# EAGLE schematic badge (EAGLE 8.3.1)
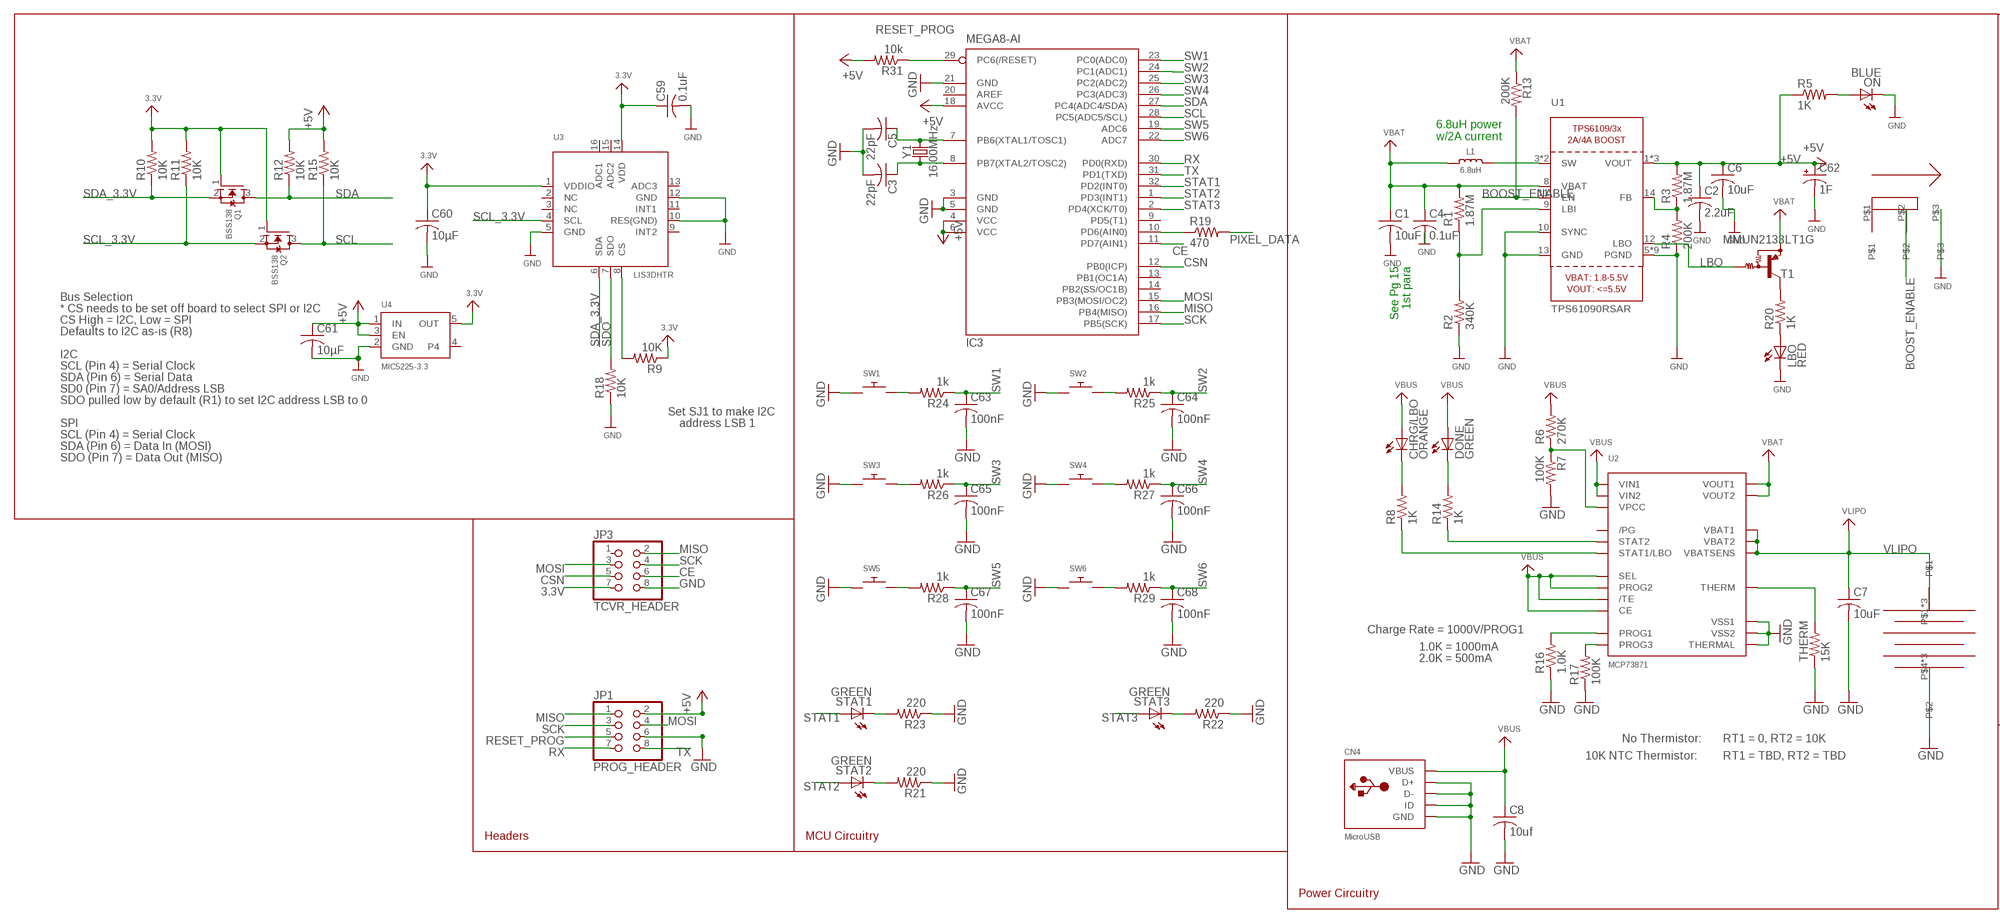
[diagram p0: schematic, sheet 1, part 1 of 2]
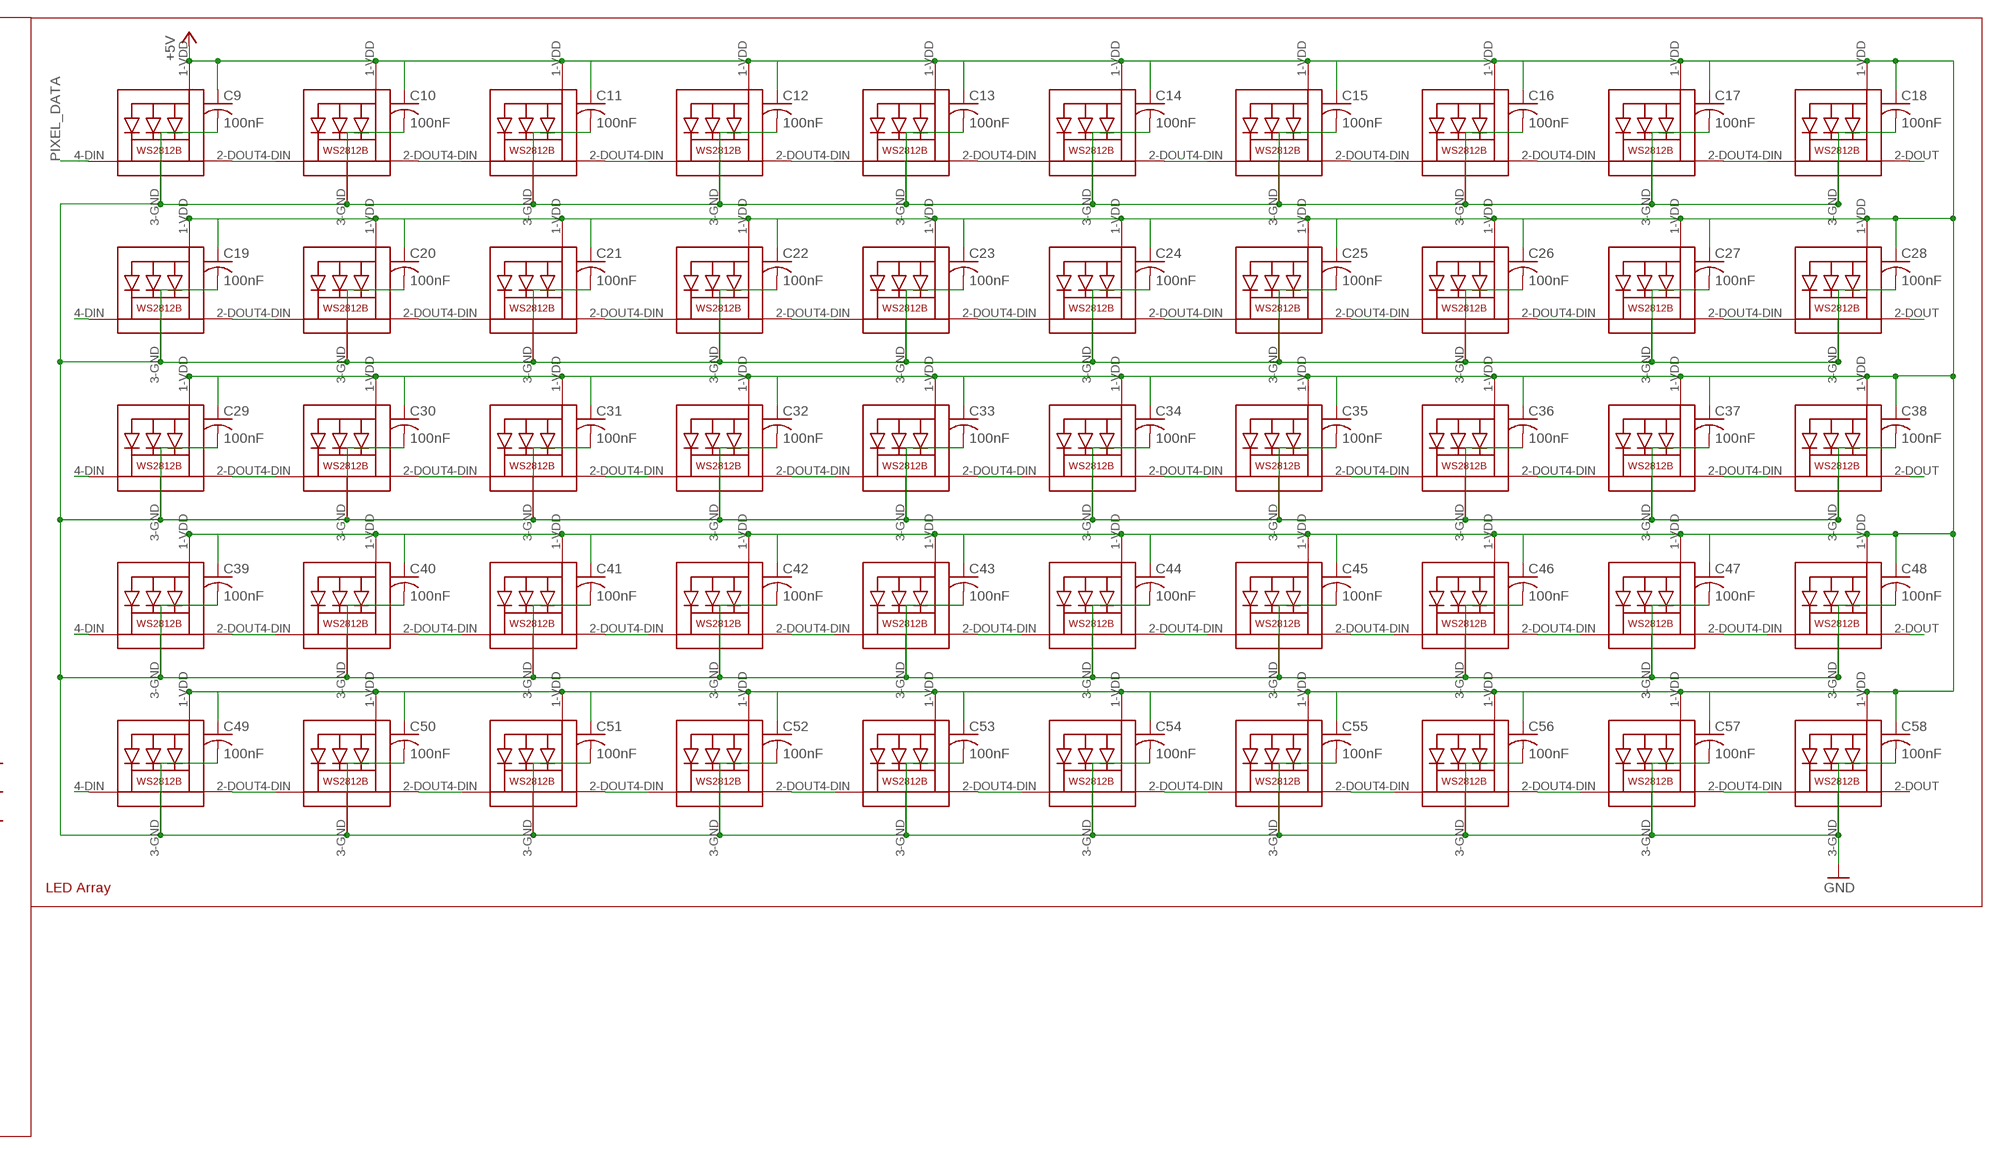
[diagram p1: schematic, sheet 1, part 2 of 2]

## Parts
C1  10uF  C-USC1210  [C1210]
C2  2.2uF  C-USC0805  [C0805]
C3  22pF  C-USC0603  [C0603]
C4  0.1uF  C-USC0805  [C0805]
C5  22pF  C-USC0603  [C0603]
C6  10uF  C-USC1210  [C1210]
C7  10uF  C-USC1210  [C1210]
C8  10uf  C-USC0805  [C0805]
C9  100nF  C-USC0603  [C0603]
C10  100nF  C-USC0603  [C0603]
C11  100nF  C-USC0603  [C0603]
C12  100nF  C-USC0603  [C0603]
C13  100nF  C-USC0603  [C0603]
C14  100nF  C-USC0603  [C0603]
C15  100nF  C-USC0603  [C0603]
C16  100nF  C-USC0603  [C0603]
C17  100nF  C-USC0603  [C0603]
C18  100nF  C-USC0603  [C0603]
C19  100nF  C-USC0603  [C0603]
C20  100nF  C-USC0603  [C0603]
C21  100nF  C-USC0603  [C0603]
C22  100nF  C-USC0603  [C0603]
C23  100nF  C-USC0603  [C0603]
C24  100nF  C-USC0603  [C0603]
C25  100nF  C-USC0603  [C0603]
C26  100nF  C-USC0603  [C0603]
C27  100nF  C-USC0603  [C0603]
C28  100nF  C-USC0603  [C0603]
C29  100nF  C-USC0603  [C0603]
C30  100nF  C-USC0603  [C0603]
C31  100nF  C-USC0603  [C0603]
C32  100nF  C-USC0603  [C0603]
C33  100nF  C-USC0603  [C0603]
C34  100nF  C-USC0603  [C0603]
C35  100nF  C-USC0603  [C0603]
C36  100nF  C-USC0603  [C0603]
C37  100nF  C-USC0603  [C0603]
C38  100nF  C-USC0603  [C0603]
C39  100nF  C-USC0603  [C0603]
C40  100nF  C-USC0603  [C0603]
C41  100nF  C-USC0603  [C0603]
C42  100nF  C-USC0603  [C0603]
C43  100nF  C-USC0603  [C0603]
C44  100nF  C-USC0603  [C0603]
C45  100nF  C-USC0603  [C0603]
C46  100nF  C-USC0603  [C0603]
C47  100nF  C-USC0603  [C0603]
C48  100nF  C-USC0603  [C0603]
C49  100nF  C-USC0603  [C0603]
C50  100nF  C-USC0603  [C0603]
C51  100nF  C-USC0603  [C0603]
C52  100nF  C-USC0603  [C0603]
C53  100nF  C-USC0603  [C0603]
C54  100nF  C-USC0603  [C0603]
C55  100nF  C-USC0603  [C0603]
C56  100nF  C-USC0603  [C0603]
C57  100nF  C-USC0603  [C0603]
C58  100nF  C-USC0603  [C0603]
C59  0.1uF  C-USC0603  [C0603]
C60  10µF  C-USC0805  [C0805]
C61  10µF  C-USC0805  [C0805]
C62  1F  CPOL-USE5-8.5  [E5-8,5]
C63  100nF  C-USC0603  [C0603]
C64  100nF  C-USC0603  [C0603]
C65  100nF  C-USC0603  [C0603]
C66  100nF  C-USC0603  [C0603]
C67  100nF  C-USC0603  [C0603]
C68  100nF  C-USC0603  [C0603]
CHRG/LBO  ORANGE  ADAFRUIT_LEDCHIPLED_0603  [ADAFRUIT_CHIPLED_0603]
CN4  MicroUSB  USBMICRO_20329  [4UCONN_20329]
DONE  GREEN  ADAFRUIT_LEDCHIPLED_0603  [ADAFRUIT_CHIPLED_0603]
IC3  MEGA8-AI  [TQFP32-08]
JP1  PROG_HEADER  PINHD-2X4  [2X04]
JP3  TCVR_HEADER  PINHD-2X4  [2X04]
L1  6.8uH  INDUCTORTDK_VLC5045  [INDUCTOR_5X5MM_TDK_VLC5045]
LBO  RED  ADAFRUIT_LEDCHIPLED_0603  [ADAFRUIT_CHIPLED_0603]
LED1  WS2812B5050-NARROW  [WS2812B-NARROW]
LED2  WS2812B5050-NARROW  [WS2812B-NARROW]
LED3  WS2812B5050-NARROW  [WS2812B-NARROW]
LED4  WS2812B5050-NARROW  [WS2812B-NARROW]
LED5  WS2812B5050-NARROW  [WS2812B-NARROW]
LED6  WS2812B5050-NARROW  [WS2812B-NARROW]
LED7  WS2812B5050-NARROW  [WS2812B-NARROW]
LED8  WS2812B5050-NARROW  [WS2812B-NARROW]
LED9  WS2812B5050-NARROW  [WS2812B-NARROW]
LED10  WS2812B5050-NARROW  [WS2812B-NARROW]
LED11  WS2812B5050-NARROW  [WS2812B-NARROW]
LED12  WS2812B5050-NARROW  [WS2812B-NARROW]
LED13  WS2812B5050-NARROW  [WS2812B-NARROW]
LED14  WS2812B5050-NARROW  [WS2812B-NARROW]
LED15  WS2812B5050-NARROW  [WS2812B-NARROW]
LED16  WS2812B5050-NARROW  [WS2812B-NARROW]
LED17  WS2812B5050-NARROW  [WS2812B-NARROW]
LED18  WS2812B5050-NARROW  [WS2812B-NARROW]
LED19  WS2812B5050-NARROW  [WS2812B-NARROW]
LED20  WS2812B5050-NARROW  [WS2812B-NARROW]
LED21  WS2812B5050-NARROW  [WS2812B-NARROW]
LED22  WS2812B5050-NARROW  [WS2812B-NARROW]
LED23  WS2812B5050-NARROW  [WS2812B-NARROW]
LED24  WS2812B5050-NARROW  [WS2812B-NARROW]
LED25  WS2812B5050-NARROW  [WS2812B-NARROW]
LED26  WS2812B5050-NARROW  [WS2812B-NARROW]
LED27  WS2812B5050-NARROW  [WS2812B-NARROW]
LED28  WS2812B5050-NARROW  [WS2812B-NARROW]
LED29  WS2812B5050-NARROW  [WS2812B-NARROW]
LED30  WS2812B5050-NARROW  [WS2812B-NARROW]
LED31  WS2812B5050-NARROW  [WS2812B-NARROW]
LED32  WS2812B5050-NARROW  [WS2812B-NARROW]
LED33  WS2812B5050-NARROW  [WS2812B-NARROW]
LED34  WS2812B5050-NARROW  [WS2812B-NARROW]
LED35  WS2812B5050-NARROW  [WS2812B-NARROW]
LED36  WS2812B5050-NARROW  [WS2812B-NARROW]
LED37  WS2812B5050-NARROW  [WS2812B-NARROW]
LED38  WS2812B5050-NARROW  [WS2812B-NARROW]
LED39  WS2812B5050-NARROW  [WS2812B-NARROW]
LED40  WS2812B5050-NARROW  [WS2812B-NARROW]
LED41  WS2812B5050-NARROW  [WS2812B-NARROW]
LED42  WS2812B5050-NARROW  [WS2812B-NARROW]
LED43  WS2812B5050-NARROW  [WS2812B-NARROW]
LED44  WS2812B5050-NARROW  [WS2812B-NARROW]
LED45  WS2812B5050-NARROW  [WS2812B-NARROW]
LED46  WS2812B5050-NARROW  [WS2812B-NARROW]
LED47  WS2812B5050-NARROW  [WS2812B-NARROW]
LED48  WS2812B5050-NARROW  [WS2812B-NARROW]
LED49  WS2812B5050-NARROW  [WS2812B-NARROW]
LED50  WS2812B5050-NARROW  [WS2812B-NARROW]
ON  BLUE  ADAFRUIT_LEDCHIPLED_0603  [ADAFRUIT_CHIPLED_0603]
Q1  BSS138  MOSFET-NWIDE  [SOT23-WIDE]
Q2  BSS138  MOSFET-NWIDE  [SOT23-WIDE]
R1  1.87M  R-US_R0805  [R0805]
R2  340K  R-US_R0805  [R0805]
R3  1.87M  R-US_R0805  [R0805]
R4  200K  R-US_R0805  [R0805]
R5  1K  R-US_R0805  [R0805]
R6  270K  R-US_R0805  [R0805]
R7  100K  R-US_R0805  [R0805]
R8  1K  R-US_R0805  [R0805]
R9  10K  R-US_R0603  [R0603]
R10  10K  R-US_R0603  [R0603]
R11  10K  R-US_R0603  [R0603]
R12  10K  R-US_R0603  [R0603]
R13  200K  R-US_R0805  [R0805]
R14  1K  R-US_R0805  [R0805]
R15  10K  R-US_R0603  [R0603]
R16  1.0K  R-US_R0805  [R0805]
R17  100K  R-US_R0805  [R0805]
R18  10K  R-US_R0603  [R0603]
R19  470  R-US_R0805  [R0805]
R20  1K  R-US_R0805  [R0805]
R21  220  R-US_M0805  [M0805]
R22  220  R-US_M0805  [M0805]
R23  220  R-US_M0805  [M0805]
R24  1k  R-US_R0603  [R0603]
R25  1k  R-US_R0603  [R0603]
R26  1k  R-US_R0603  [R0603]
R27  1k  R-US_R0603  [R0603]
R28  1k  R-US_R0603  [R0603]
R29  1k  R-US_R0603  [R0603]
R31  10k  R-US_M0805  [M0805]
STAT1  GREEN  ADAFRUIT_LEDCHIPLED_0603  [ADAFRUIT_CHIPLED_0603]
STAT2  GREEN  ADAFRUIT_LEDCHIPLED_0603  [ADAFRUIT_CHIPLED_0603]
STAT3  GREEN  ADAFRUIT_LEDCHIPLED_0603  [ADAFRUIT_CHIPLED_0603]
SW1  SWITCH_PUSHBUTTONEVQ-PE  [TACT_PANA-EVQ]
SW2  SWITCH_PUSHBUTTONEVQ-PE  [TACT_PANA-EVQ]
SW3  SWITCH_PUSHBUTTONEVQ-PE  [TACT_PANA-EVQ]
SW4  SWITCH_PUSHBUTTONEVQ-PE  [TACT_PANA-EVQ]
SW5  SWITCH_PUSHBUTTONEVQ-PE  [TACT_PANA-EVQ]
SW6  SWITCH_PUSHBUTTONEVQ-PE  [TACT_PANA-EVQ]
T1  MMUN2133LT1G  TRANSISTOR_MUN2113T1-PNP_DRIVER-SC59-BEC  [TRANSISTOR_SC59-BEC]
THERM  15K  R-US_R0805  [R0805]
U1  TPS61090RSAR  VREG_TPS6103X  [PVQFN-16]
U2  MCP73871  [QFN20_4MM]
U3  LIS3DHTR  ACCEL_LIS3DHTR  [LGA16_3X3MM]
U4  MIC5225-3.3  VREG_SOT23-5  [SOT23-5]
U$17  CL-SB-12A-02T  [CL-SB-12A-02T]
U$22  54_BATTERY_CLIP  [54_BATTERY_CLIP]
Y1  16.00MHz  CRYSTALSMD-3.2X2.5  [CRYSTAL-SMD-3.2X2.5MM]

## Nets
3.3V: C59.1 C60.1 JP3.7 Q1.1(G) Q2.1(G) R9.1 R10.2 R11.2 U3.1(VDDIO) U3.14(VDD) U4.5(OUT)
+5V: C2.1 C6.1 C9.1 C10.1 C11.1 C12.1 C13.1 C14.1 C15.1 C16.1 C17.1 C18.1 C19.1 C20.1 C21.1 C22.1 C23.1 C24.1 C25.1 C26.1 C27.1 C28.1 C29.1 C30.1 C31.1 C32.1 C33.1 C34.1 C35.1 C36.1 C37.1 C38.1 C39.1 C40.1 C41.1 C42.1 C43.1 C44.1 C45.1 C46.1 C47.1 C48.1 C49.1 C50.1 C51.1 C52.1 C53.1 C54.1 C55.1 C56.1 C57.1 C58.1 C61.1 C62.+ IC3.4(VCC) IC3.6(VCC) IC3.18(AVCC) JP1.2 LED1.1-VDD(VDD) LED2.1-VDD(VDD) LED3.1-VDD(VDD) LED4.1-VDD(VDD) LED5.1-VDD(VDD) LED6.1-VDD(VDD) LED7.1-VDD(VDD) LED8.1-VDD(VDD) LED9.1-VDD(VDD) LED10.1-VDD(VDD) LED11.1-VDD(VDD) LED12.1-VDD(VDD) LED13.1-VDD(VDD) LED14.1-VDD(VDD) LED15.1-VDD(VDD) LED16.1-VDD(VDD) LED17.1-VDD(VDD) LED18.1-VDD(VDD) LED19.1-VDD(VDD) LED20.1-VDD(VDD) LED21.1-VDD(VDD) LED22.1-VDD(VDD) LED23.1-VDD(VDD) LED24.1-VDD(VDD) LED25.1-VDD(VDD) LED26.1-VDD(VDD) LED27.1-VDD(VDD) LED28.1-VDD(VDD) LED29.1-VDD(VDD) LED30.1-VDD(VDD) LED31.1-VDD(VDD) LED32.1-VDD(VDD) LED33.1-VDD(VDD) LED34.1-VDD(VDD) LED35.1-VDD(VDD) LED36.1-VDD(VDD) LED37.1-VDD(VDD) LED38.1-VDD(VDD) LED39.1-VDD(VDD) LED40.1-VDD(VDD) LED41.1-VDD(VDD) LED42.1-VDD(VDD) LED43.1-VDD(VDD) LED44.1-VDD(VDD) LED45.1-VDD(VDD) LED46.1-VDD(VDD) LED47.1-VDD(VDD) LED48.1-VDD(VDD) LED49.1-VDD(VDD) LED50.1-VDD(VDD) R3.2 R5.1 R12.2 R15.2 R31.2 U1.1(VOUT) U1.15(VOUT) U1.16(VOUT) U4.1(IN) U4.3(EN)
BOOST_ENABLE: R13.2 U1.11(EN) U$17.P$2
CE: IC3.11(PD7(AIN1)) JP3.6
CSN: IC3.12(PB0(ICP)) JP3.5
GND: C1.2 C2.2 C3.2 C4.2 C5.2 C6.2 C7.2 C8.2 C9.2 C10.2 C11.2 C12.2 C13.2 C14.2 C15.2 C16.2 C17.2 C18.2 C19.2 C20.2 C21.2 C22.2 C23.2 C24.2 C25.2 C26.2 C27.2 C28.2 C29.2 C30.2 C31.2 C32.2 C33.2 C34.2 C35.2 C36.2 C37.2 C38.2 C39.2 C40.2 C41.2 C42.2 C43.2 C44.2 C45.2 C46.2 C47.2 C48.2 C49.2 C50.2 C51.2 C52.2 C53.2 C54.2 C55.2 C56.2 C57.2 C58.2 C59.2 C60.2 C61.2 C62.- C63.2 C64.2 C65.2 C66.2 C67.2 C68.2 CN4.BASE@1(GND) CN4.BASE@2(GND) CN4.D+ CN4.D- CN4.GND CN4.ID CN4.SPRT@1(GND) CN4.SPRT@2(GND) CN4.SPRT@3(GND) CN4.SPRT@4(GND) IC3.3(GND) IC3.5(GND) IC3.21(GND) JP1.6 JP3.8 LBO.C LED1.3-GND(GND) LED2.3-GND(GND) LED3.3-GND(GND) LED4.3-GND(GND) LED5.3-GND(GND) LED6.3-GND(GND) LED7.3-GND(GND) LED8.3-GND(GND) LED9.3-GND(GND) LED10.3-GND(GND) LED11.3-GND(GND) LED12.3-GND(GND) LED13.3-GND(GND) LED14.3-GND(GND) LED15.3-GND(GND) LED16.3-GND(GND) LED17.3-GND(GND) LED18.3-GND(GND) LED19.3-GND(GND) LED20.3-GND(GND) LED21.3-GND(GND) LED22.3-GND(GND) LED23.3-GND(GND) LED24.3-GND(GND) LED25.3-GND(GND) LED26.3-GND(GND) LED27.3-GND(GND) LED28.3-GND(GND) LED29.3-GND(GND) LED30.3-GND(GND) LED31.3-GND(GND) LED32.3-GND(GND) LED33.3-GND(GND) LED34.3-GND(GND) LED35.3-GND(GND) LED36.3-GND(GND) LED37.3-GND(GND) LED38.3-GND(GND) LED39.3-GND(GND) LED40.3-GND(GND) LED41.3-GND(GND) LED42.3-GND(GND) LED43.3-GND(GND) LED44.3-GND(GND) LED45.3-GND(GND) LED46.3-GND(GND) LED47.3-GND(GND) LED48.3-GND(GND) LED49.3-GND(GND) LED50.3-GND(GND) ON.C R2.1 R4.1 R7.2 R16.1 R17.1 R18.1 R21.1 R22.1 R23.1 SW1.P$1 SW2.P$1 SW3.P$1 SW4.P$1 SW5.P$1 SW6.P$1 THERM.1 U1.5(PGND) U1.6(PGND) U1.7(PGND) U1.10(SYNC) U1.13(GND) U1.P$18(PGND) U1.P$19(PGND) U1.P$20(PGND) U1.P$21(PGND) U1.P$22(PGND) U1.THERMAL(PGND) U2.P$10(VSS1) U2.P$11(VSS2) U2.P$21(THERMAL) U3.5(GND) U3.10(RES(GND)) U3.12(GND) U4.2(GND) U$17.P$3 U$22.P$4 U$22.P$5 U$22.P$6
LBO: T1.B U1.12(LBO)
MISO: IC3.16(PB4(MISO)) JP1.1 JP3.2
MOSI: IC3.15(PB3(MOSI/OC2)) JP1.4 JP3.3
N$1: L1.P$2 U1.3(SW) U1.4(SW)
N$2: LBO.A R20.1
N$3: R1.1 R2.2 U1.9(LBI)
N$4: ON.A R5.2
N$5: R3.1 R4.2 U1.14(FB)
N$6: R20.2 T1.C
N$7: R6.1 R7.1 U2.P$2(VPCC)
N$8: DONE.C R14.2
N$9: R14.1 U2.P$7(STAT2)
N$10: THERM.2 U2.P$5(THERM)
N$11: R8.1 U2.P$8(STAT1/LBO)
N$12: CHRG/LBO.C R8.2
N$13: R17.2 U2.P$12(PROG3)
N$14: C5.1 IC3.7(PB6(XTAL1/TOSC1)) Y1.3
N$15: C3.1 IC3.8(PB7(XTAL2/TOSC2)) Y1.1
N$16: R16.2 U2.P$13(PROG1)
N$17: LED2.2-DOUT(DO) LED3.4-DIN(DI)
N$19: R9.2 U3.8(CS)
N$20: R21.2 STAT2.C
N$21: R22.2 STAT3.C
N$22: R23.2 STAT1.C
N$23: R24.2 SW1.P$2
N$24: LED1.2-DOUT(DO) LED2.4-DIN(DI)
N$25: LED3.2-DOUT(DO) LED4.4-DIN(DI)
N$26: LED4.2-DOUT(DO) LED5.4-DIN(DI)
N$27: LED5.2-DOUT(DO) LED6.4-DIN(DI)
N$30: R26.2 SW3.P$2
N$31: R28.2 SW5.P$2
N$32: R29.2 SW6.P$2
N$33: R27.2 SW4.P$2
N$34: R25.2 SW2.P$2
N$37: LED6.2-DOUT(DO) LED7.4-DIN(DI)
N$38: LED7.2-DOUT(DO) LED8.4-DIN(DI)
N$39: LED8.2-DOUT(DO) LED9.4-DIN(DI)
N$40: LED9.2-DOUT(DO) LED10.4-DIN(DI)
N$41: LED10.2-DOUT(DO) LED11.4-DIN(DI)
N$42: LED11.2-DOUT(DO) LED12.4-DIN(DI)
N$43: LED12.2-DOUT(DO) LED13.4-DIN(DI)
N$44: LED13.2-DOUT(DO) LED14.4-DIN(DI)
N$45: LED14.2-DOUT(DO) LED15.4-DIN(DI)
N$46: LED15.2-DOUT(DO) LED16.4-DIN(DI)
N$47: LED16.2-DOUT(DO) LED17.4-DIN(DI)
N$48: LED17.2-DOUT(DO) LED18.4-DIN(DI)
N$49: LED18.2-DOUT(DO) LED19.4-DIN(DI)
N$50: LED19.2-DOUT(DO) LED20.4-DIN(DI)
N$51: LED20.2-DOUT(DO) LED21.4-DIN(DI)
N$52: LED21.2-DOUT(DO) LED22.4-DIN(DI)
N$53: LED22.2-DOUT(DO) LED23.4-DIN(DI)
N$54: LED23.2-DOUT(DO) LED24.4-DIN(DI)
N$55: LED24.2-DOUT(DO) LED25.4-DIN(DI)
N$56: LED25.2-DOUT(DO) LED26.4-DIN(DI)
N$57: LED26.2-DOUT(DO) LED27.4-DIN(DI)
N$58: LED27.2-DOUT(DO) LED28.4-DIN(DI)
N$59: LED28.2-DOUT(DO) LED29.4-DIN(DI)
N$60: LED29.2-DOUT(DO) LED30.4-DIN(DI)
N$61: LED30.2-DOUT(DO) LED31.4-DIN(DI)
N$62: LED31.2-DOUT(DO) LED32.4-DIN(DI)
N$63: LED32.2-DOUT(DO) LED33.4-DIN(DI)
N$64: LED33.2-DOUT(DO) LED34.4-DIN(DI)
N$65: LED34.2-DOUT(DO) LED35.4-DIN(DI)
N$66: LED35.2-DOUT(DO) LED36.4-DIN(DI)
N$67: LED36.2-DOUT(DO) LED37.4-DIN(DI)
N$68: LED37.2-DOUT(DO) LED38.4-DIN(DI)
N$69: LED38.2-DOUT(DO) LED39.4-DIN(DI)
N$70: LED39.2-DOUT(DO) LED40.4-DIN(DI)
N$71: LED40.2-DOUT(DO) LED41.4-DIN(DI)
N$72: LED41.2-DOUT(DO) LED42.4-DIN(DI)
N$73: LED42.2-DOUT(DO) LED43.4-DIN(DI)
N$74: LED43.2-DOUT(DO) LED44.4-DIN(DI)
N$75: LED44.2-DOUT(DO) LED45.4-DIN(DI)
N$76: LED45.2-DOUT(DO) LED46.4-DIN(DI)
N$77: LED46.2-DOUT(DO) LED47.4-DIN(DI)
N$78: LED47.2-DOUT(DO) LED48.4-DIN(DI)
N$79: LED48.2-DOUT(DO) LED49.4-DIN(DI)
N$80: LED49.2-DOUT(DO) LED50.4-DIN(DI)
NEO-DOUT: IC3.10(PD6(AIN0)) R19.1
PIXEL_DATA: LED1.4-DIN(DI) R19.2
RESET_PROG: IC3.29(PC6(/RESET)) JP1.5 R31.1
RX: IC3.30(PD0(RXD)) JP1.7
SCK: IC3.17(PB5(SCK)) JP1.3 JP3.4
SCL: IC3.28(PC5(ADC5/SCL)) Q2.3(D) R15.1
SCL_3.3V: Q2.2(S) R11.1 U3.4(SCL)
SDA: IC3.27(PC4(ADC4/SDA)) Q1.3(D) R12.1
SDA_3.3V: Q1.2(S) R10.1 U3.6(SDA)
SDO: R18.2 U3.7(SDO)
STAT1: IC3.32(PD2(INT0)) STAT1.A
STAT2: IC3.1(PD3(INT1)) STAT2.A
STAT3: IC3.2(PD4(XCK/T0)) STAT3.A
SW1: C63.1 IC3.23(PC0(ADC0)) R24.1
SW2: C64.1 IC3.24(PC1(ADC1)) R25.1
SW3: C65.1 IC3.25(PC2(ADC2)) R26.1
SW4: C66.1 IC3.26(PC3(ADC3)) R27.1
SW5: C67.1 IC3.19(ADC6) R28.1
SW6: C68.1 IC3.22(ADC7) R29.1
TX: IC3.31(PD1(TXD)) JP1.8
VBAT: C1.1 C4.1 L1.P$1 R1.2 R13.1 T1.E U1.8(VBAT) U2.P$1(VOUT1) U2.P$20(VOUT2)
VBUS: C8.1 CHRG/LBO.A CN4.VBUS DONE.A R6.2 U2.P$3(SEL) U2.P$4(PROG2) U2.P$9(/TE) U2.P$17(CE) U2.P$18(VIN1) U2.P$19(VIN2)
VLIPO: C7.1 U2.P$14(VBAT1) U2.P$15(VBAT2) U2.P$16(VBATSENS) U$22.P$1 U$22.P$2 U$22.P$3
Unconnected: IC3.9(PD5(T1)) IC3.13(PB1(OC1A)) IC3.14(PB2(SS/OC1B)) IC3.20(AREF) JP3.1 LED50.2-DOUT(DO) U2.P$6(/PG) U3.2(NC) U3.3(NC) U3.9(INT2) U3.11(INT1) U3.13(ADC3) U3.15(ADC2) U3.16(ADC1) U4.4 U$17.P$1

## Notes on the sheet
- 6.8uH power
  w/2A current
- See Pg 15
  1st para
- Bus Selection
- * CS needs to be set off board to select SPI or I2C
- CS High = I2C, Low = SPI
- Defaults to I2C as-is (R8)
- I2C
- SCL (Pin 4) = Serial Clock
- SDA (Pin 6) = Serial Data
- SD0 (Pin 7) = SA0/Address LSB
- SDO pulled low by default (R1) to set I2C address LSB to 0
- Set SJ1 to make I2C
- SPI | address LSB 1
- SCL (Pin 4) = Serial Clock
- SDA (Pin 6) = Data In (MOSI)
- SDO (Pin 7) = Data Out (MISO)
- Charge Rate = 1000V/PROG1
- 1.0K = 1000mA
- 2.0K = 500mA
- LED Array
- No Thermistor: | RT1 = 0, RT2 = 10K
- 10K NTC Thermistor: | RT1 = TBD, RT2 = TBD
- Headers | MCU Circuitry
- Power Circuitry

## Library data of the parts
C1 C3 C5-C7 C9-C61 C63-C68 = resistor:C-US: CAPACITOR, American symbol
C2 C4 C8 = adafruit:C-US: CAPACITOR, American symbol
C62 = resistor:CPOL-US: POLARIZED CAPACITOR, American symbol
CHRG/LBO DONE LBO ON STAT1-STAT3 = piboy_new:ADAFRUIT_LED: LED OSRAM: - CHIPLED LG R971, LG N971, LY N971, LG Q971, LY Q971, LO R971, LY R971 LH N974, LH R974 LS Q976, LO Q976, LY Q976 LO Q996 - Hyper CHIPLED LW Q18S LB Q993, LB Q99A, LB R99A - SideLED LS A670, LO A670, LY A670, LG A670, LP A670 LB A673, LV A673, LT A673, LW A673 LH A674 LY A675 LS A676, LA A676, LO A676, LY A676, LW A676 LS A679, LY A679, LG A679 - Hyper Micro SIDELED® LS Y876, LA Y876, LO Y876, LY Y876 LT Y87S - SmartLED LW L88C, LW L88S LB L89C, LB L89S, LG L890 LS L89K, LO L89K, LY L89K LS L896, LA L896, LO L896, LY L896 - TOPLED LS T670, LO T670, LY T670, LG T670, LP T670 LSG T670, LSP T670, LSY T670, LOP T670, LYG T670 LG T671, LOG T671, LSG T671 LB T673, LV T673, LT T673, LW T673 LH T674 LS T676, LA T676, LO T676, LY T676, LB T676, LH T676, LSB T676, LW T676 LB T67C, LV T67C, LT T67C, LS T67K, LO T67K, LY T67K, LW E67C LS E67B, LA E67B, LO E67B, LY E67B, LB E67C, LV E67C, LT E67C LW T67C LS T679, LY T679, LG T679 LS T770, LO T770, LY T770, LG T770, LP T770 LB T773, LV T773, LT T773, LW T773 LH T774 LS E675, LA E675, LY E675, LS T675 LS T776, LA T776, LO T776, LY T776, LB T776 LHGB T686 LT T68C, LB T68C - Hyper Mini TOPLED® LB M676 - Mini TOPLED Santana® LG M470 LS M47K, LO M47K, LY M47K Source: http://www.osram.convergy.de/
CN4 = microbuilder:USB: USB Connectors USBMINIB - Surface Mount Female Mini-B USB Connector 4UConnector: 06564
IC3 = atmel:MEGA8: MICROCONTROLLER 8 Kbytes FLASH, 1 kbytes SRAM, 512 bytes EEPROM, USART, 6-channel 10 bit ADC, 2-channel 8 bit ADC Pin compatible with Atmega48, ATMega88, ATMega168 Source: avr.lbr; MPN: ATMEGA8-16AU; OC_FARNELL: 9171371; OC_NEWARK: 73M8863
JP1 JP3 = pinhead:PINHD-2X4: PIN HEADER
L1 = microbuilder:INDUCTOR: Inductors 0603: 10nH Ceramic Inductor - microwire antenna/RF (Digikey: 712-1434-2-ND) 0805: 560nH Ceramic Inductor - RF (Digikey: 553-1047-1-ND) 270nH Ceramic Inductor - Q = 40@250MHz, +-5%, 1 Ohm DC Resistance (Digikey: 535-10506-2-ND) 1007 (2518 Metric) SMT: 10µH 10% 250mOhm 820mA 1007 Inductor (Digikey: 587-2189-1-ND) 22µH 10% 500mOhm 580mA 1007 Inductor (Digikey: 587-2190-1-ND) 47µH 10% 950mOhm 420mA 1007 Inductor (Digikey: 587-2191-1-ND) 47µH 5% 100mOhm 1A 1008 Inductor (Digikey: 732-1816-1-ND) 5.0x5.0mm (Taiyo Yuden NR5040 Series) 6.8µH 20% 2.3A 64mOhm Inductor (Digikey: 587-2374-2-ND) 5.0x5.0mm (TDK VLC5045 Series) 4.7µH 20% 3.3A 34mOhm Inductor (Digikey: 445-6526-1-ND) 6.8µH 20% 2.7A 46mOhm Inductor (Digikey: 445-6527-1-ND) 6.0x6.0mm (TDK VLC6045 Series) 4.7µH 20% 3.8A 27mOhm Inductor (Digikey: 445-6538-2-ND) 6.8µH 20% 3A 41mOhm Inductor (Digikey: 445-6540-1-ND) 6.2µH 30% 2.2A 45mOhm Inductor (Digikey: SRR5028-6R2YCT-ND) - Not TDK VLC6045 but footprint should match 6.0x6.0mm (TDK SLF6045 Series) 6.8uH 30% 2A 33mOhm Inductor (Digikey: 445-4572-1-ND, Mouser: 810-SLF645T6R8N2R0PF) 6.0x6.0mm (Sumida CDRH5D28 Series) 6.2uH 30% 1.8A 45mOhm Inductor (Digikey: 308-1542-1-ND) Taiyo Yuden NR3015T2R2M - 2.2uH 20% 1.5A (Digikey: 587-1648-2-ND, Mouser: 963-NR3015T2R2M) - Used with TI TPS62172 CoilCraft RFID Transponder Coil - MA5532-AE (For use with AS3935 Lightning Sensor) Vishay IHLP 1.0uH Molded Inductor - 24mOhm DCR, 5A, +/-20%, -55°C-125°C (Digikey: 541-1319-1-ND)
LED1-LED50 = defcon:WS2812B5050
Q1 Q2 = microbuilder:MOSFET-N: N-Channel Mosfet LEGEND VDS: Voltage Drain-Source ID: Drain Current RDS(ON): Drain-Source On-State Resistance VGS(TH): Gate-Source Threshold Voltage CISS: Drain-Source Input Capacitance SOT-23 Name VDS ID RDS(ON) VGS(TH) CISS Order Number 2N7002E 60V 260mA 2.5 Ohm 2.5V @ 250uA 26.7pF @ 25V 2N7002ET1GOSTR-ND BSH103 30V 850mA 400 mOhm 400mV @ 1mA 83pF @ 24V BSH103,235-ND BSS138 60V 320mA 1.6 Ohm 1.5V @ 250uA 50pF @ 10V Mouser: 771-BSS138PW115 DMN2075U-7 20V 4.2A 38 mOhm 1V @ 250 uA 594.3pF @ 10V DMN2075U-7DICT-ND * BSS138 good choice for I2C level-shifting POWERPAK 1212-8 Name VDS ID RDS(ON) VGS(TH) CISS Order Number Si7308DN 60V 6A 58 mOhm 3V @ 250uA 665pF @ 15V SI7308DN-T1-E3CT-ND
R1-R8 R13 R14 R16 R17 R20 THERM = adafruit:R-US_: RESISTOR, American symbol
R9-R12 R15 R18 R19 R21-R29 = resistor:R-US_: RESISTOR, American symbol
R31 = rcl:R-US_: RESISTOR, American symbol
SW1-SW6 = adafruit:SWITCH_PUSHBUTTON: Buttons SOFTTOUCHSMD_SJ - Soft touch temporary push button (Super Junk Akihabara) Compatible with SKPMANE010 [Mouser: 688-SKPMAN] C&K_KSS = Digikey: KSS221GLFS
T1 = piboy_new:TRANSISTOR_*-PNP_DRIVER-: PNP Bias Resistor Transistor
U1 = microbuilder:VREG_TPS6103X: TPS6103x 4A Boost - 1.8-5.5V Input, Adjustable Output to 5.5V
U2 = microbuilder:MCP73871: MCP73871 Lithium Polymer Battery Charger Digikey: MCP73871-2CCI/ML-ND
U3 = microbuilder:ACCEL_LIS3DHTR: LIS3DHTR 3-Axis Accelerometer with I2C/SPI Interface VDD: 1.71-3.6V VDDIO: 1.71-VDD+0.1V Scale: +/-2g, 4g, 8g, 16g with 16--bit data output Temp:: -40°C - 85°C Mouser: 511-LIS3DHTR Digikey: 497-10613-1-ND
U4 = microbuilder:VREG_SOT23-5: SOT23-5 Fixed Voltage Regulators Part Current Out V Out V In V Dropout θJA (°C/W) TJ (°C) Digikey Part No. ADP121 150mA 3.3V 3.4-5.5V 0.09V @ 150mA -- -- ADP121-AUJZ33R7CT-ND ADP121 150mA 3.0V 3.1-5.5V 0.09V @ 150mA -- -- ADP121-AUJZ30R7CT-ND ADP122 300mA 3.3V 3.4-5.5V 0.085V @ 300mA -- -- ADP122AUJZ-3.3-R7CT-ND ADP1712 300mA 3.3V 3.5-5.5V 0.17V @ 300mA -- -- ADP1712AUJZ-3.3-R7TR-ND AP7311 (Low Cost) 150mA 3.3V 3.5-6V 0.15V @ 150mA -- -- AP7311-33WG-7DICT-ND LD39015M18R 150mA 1.8V 1.9V-5.5V 0.08V @ 100mA -- -- 497-6977-1-ND LP2985A-33DBVR 150mA 3.3V 3.3-16V 0.28V @ 150mA 206 150 296-18479-1-ND MCP1824T-3302E/OT 300mA 3.3V 3.5V-6V 0.2V @ 300mA -- -- MCP1824T-3302E/OTCT-ND MIC5205-2.5YM5 TR 150mA 2.5V 2.7-16V 0.165V @ 150mA -- -- 576-1257-2-ND MIC5205-3.0YM5 TR 150mA 3.0V 3.2V-16V 0.165V @ 150mA -- -- 576-1258-2-ND MIC5205-3.3YM5 TR 150mA 3.3V 3.5V-16V 0.165V @ 150mA -- -- 576-1259-2-ND TPS780330220 150mA 3.3V+2.2V 3.6-5.5V 250mV Max -- -- 296-23332-1-ND TDA3663/N1,135 100mA 3.3V 3.5-45V 0.18V @ 50mA -- -- 568-5343-1-ND Max operating temp can be calculated using θJA, TJ (max junction temperature), and power in watts. Set the "Maximum Ambient Temperature" until it reaches TJ ("Max Junction Temperature"), which is the absolute limit for safe use of the regulator: Heat Sink Temperature Calculator <http://www.daycounter.com/Calculators/Heat-Sink-Temperature-Calculator.phtml> For example, With 12V source into a 3.3V LP2985 and a 30mA load, we are dissipating (12V-3.3V) * 0.03A = 0.261W. With a θJA of 206 °C/W, a TJ of 150°C, and 261mW we can safely use the chip without a heat sink up to 75°C (=147.1°C Junction Temperature).
U$17 = defcon:CL-SB-12A-02T
U$22 = defcon:54_BATTERY_CLIP
Y1 = SparkFun-Clocks:CRYSTAL: Crystals (Generic) These are passive quartz crystals, which can be used as a clock source for a microcontroller. Crystal's are two-terminal devices. They require external "load" capacitors to generate an oscillating signal.